# Altium schematic sheet VESC_POWER_SCH.SchDoc
size 297 x 209 mm
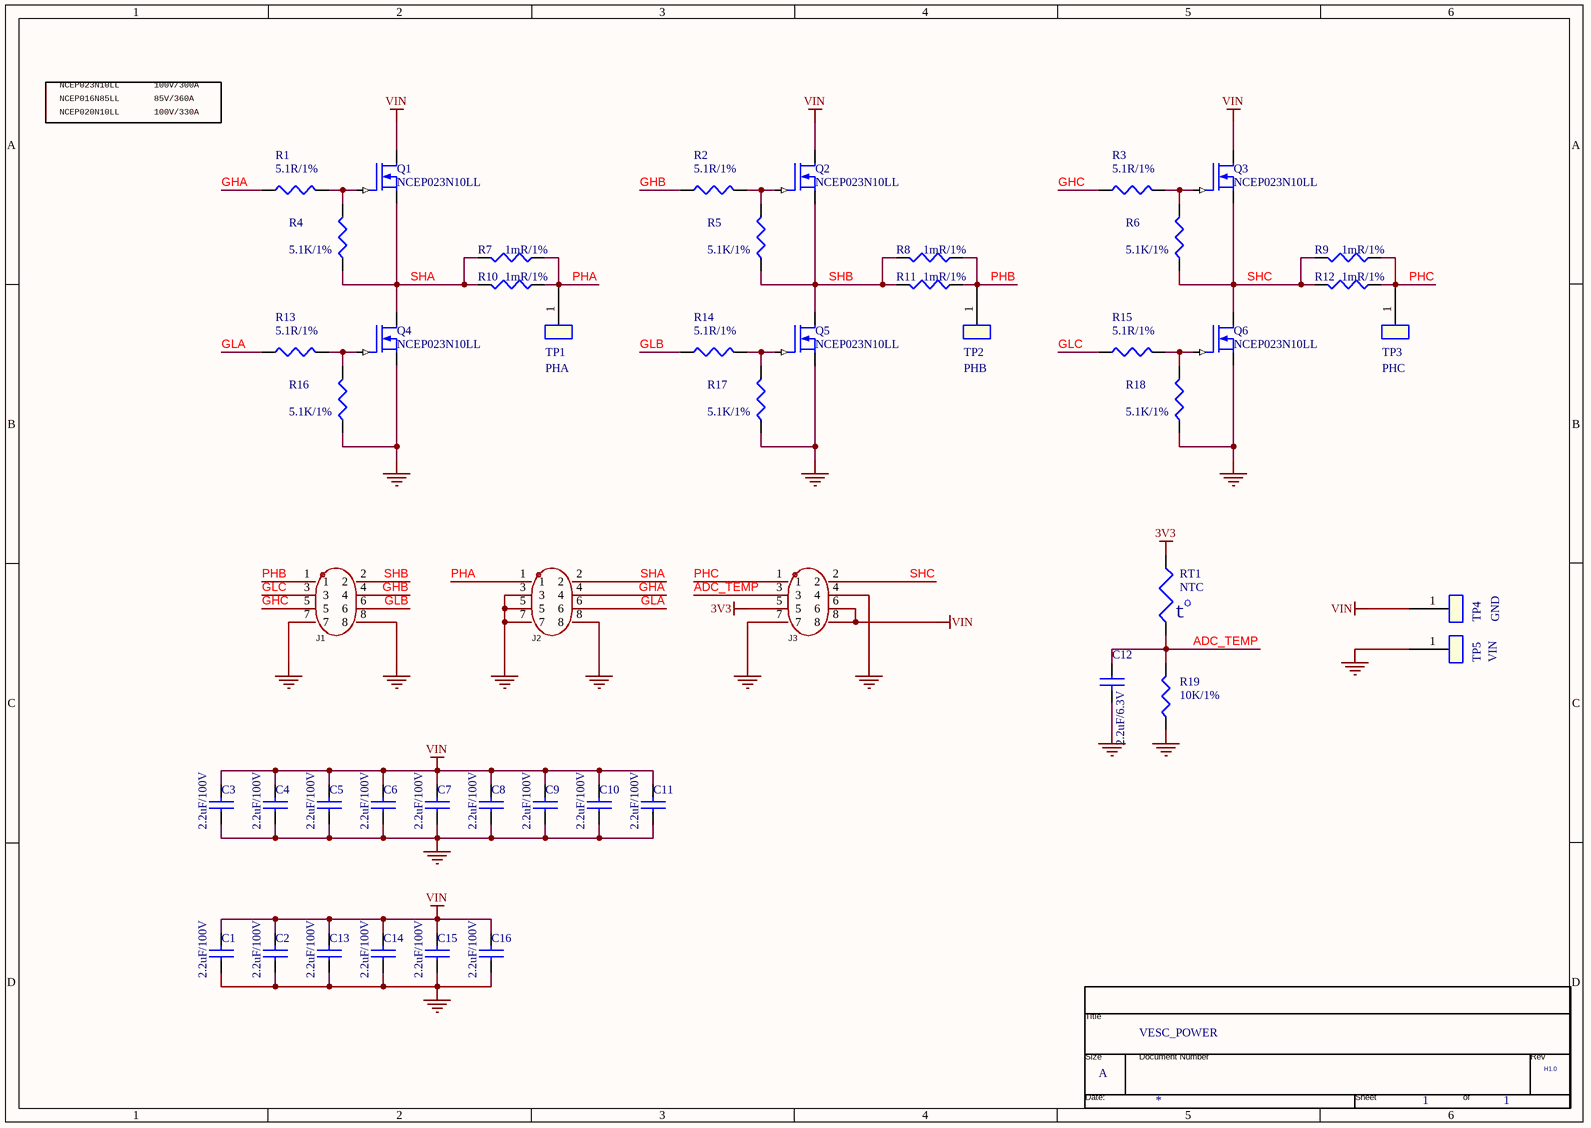
[diagram p0: VESC_POWER_SCH.SchDoc]

## Parts
*  RevCode: H1.0  Title: VESC_POWER  Page Size: A  Page Number: 1  (hidden comment: TitleBlock0)  (graphical)
C1  2.2uF/100V  [CAPC3225X230N]
C2  2.2uF/100V  [CAPC3225X230N]
C3  2.2uF/100V  [CAPC3225X230N]
C4  2.2uF/100V  [CAPC3225X230N]
C5  2.2uF/100V  [CAPC3225X230N]
C6  2.2uF/100V  [CAPC3225X230N]
C7  2.2uF/100V  [CAPC3225X230N]
C8  2.2uF/100V  [CAPC3225X230N]
C9  2.2uF/100V  [CAPC3225X230N]
C10  2.2uF/100V  [CAPC3225X230N]
C11  2.2uF/100V  [CAPC3225X230N]
C12  2.2uF/6.3V  [C0603]
C13  2.2uF/100V  [CAPC3225X230N]
C14  2.2uF/100V  [CAPC3225X230N]
C15  2.2uF/100V  [CAPC3225X230N]
C16  2.2uF/100V  [CAPC3225X230N]
J1  X6521WVS-2x04H-C60D74  [HDR-SMD_8P-P1.27-V-M-C2-C4-LS5.3]  (value not drawn)
J2  X6521WVS-2x04H-C60D74  [HDR-SMD_8P-P1.27-V-M-C2-C4-LS5.3]  (value not drawn)
J3  X6521WVS-2x04H-C60D74  [HDR-SMD_8P-P1.27-V-M-C2-C4-LS5.3]  (value not drawn)
Q1  NCEP023N10LL  [TOLL]
Q2  NCEP023N10LL  [TOLL]
Q3  NCEP023N10LL  [TOLL]
Q4  NCEP023N10LL  [TOLL]
Q5  NCEP023N10LL  [TOLL]
Q6  NCEP023N10LL  [TOLL]
R1  5.1R/1%  [R0603]
R2  5.1R/1%  [R0603]
R3  5.1R/1%  [R0603]
R4  5.1K/1%  [R0603]
R5  5.1K/1%  [R0603]
R6  5.1K/1%  [R0603]
R7  1mR/1%  [R3920]
R8  1mR/1%  [R3920]
R9  1mR/1%  [R3920]
R10  1mR/1%  [R3920]
R11  1mR/1%  [R3920]
R12  1mR/1%  [R3920]
R13  5.1R/1%  [R0603]
R14  5.1R/1%  [R0603]
R15  5.1R/1%  [R0603]
R16  5.1K/1%  [R0603]
R17  5.1K/1%  [R0603]
R18  5.1K/1%  [R0603]
R19  10K/1%  [R0603]
RT1  NTC  [R0603]
TP1  PHA  [TP_8x8]
TP2  PHB  [TP_8x8]
TP3  PHC  [TP_8x8]
TP4  GND  [TP_8x8]
TP5  VIN  [TP_8x8]

## Nets
3V3: J3.5 RT1.1
GND: C1.1 C2.1 C3.1 C4.1 C5.1 C6.1 C7.1 C8.1 C9.1 C10.1 C11.1 C12.2 C13.1 C14.1 C15.1 C16.1 J1.7 J1.8 J2.3 J2.5 J2.7 J2.8 J3.4 J3.7 Q4.3(SOURCE) Q5.3(SOURCE) Q6.3(SOURCE) R16.1 R17.1 R18.1 R19.1 TP5.1
VIN: C1.2 C2.2 C3.2 C4.2 C5.2 C6.2 C7.2 C8.2 C9.2 C10.2 C11.2 C13.2 C14.2 C15.2 C16.2 J3.6 J3.8 Q1.2(DRAIN) Q2.2(DRAIN) Q3.2(DRAIN) TP4.1
ADC_TEMP: C12.1 J3.3 R19.2 RT1.2
GHA: J2.4 R1.1
GHB: J1.4 R2.1
GHC: J1.5 R3.1
GLA: J2.6 R13.1
GLB: J1.6 R14.1
GLC: J1.3 R15.1
PHA: J2.1 R7.1 R10.1 TP1.1
PHB: J1.1 R8.1 R11.1 TP2.1
PHC: J3.1 R9.1 R12.1 TP3.1
SHA: J2.2 Q1.3(SOURCE) Q4.2(DRAIN) R4.1 R7.2 R10.2
SHB: J1.2 Q2.3(SOURCE) Q5.2(DRAIN) R5.1 R8.2 R11.2
SHC: J3.2 Q3.3(SOURCE) Q6.2(DRAIN) R6.1 R9.2 R12.2
NetQ1_1: Q1.1(GATE) R1.2 R4.2
NetQ2_1: Q2.1(GATE) R2.2 R5.2
NetQ3_1: Q3.1(GATE) R3.2 R6.2
NetQ4_1: Q4.1(GATE) R13.2 R16.2
NetQ5_1: Q5.1(GATE) R14.2 R17.2
NetQ6_1: Q6.1(GATE) R15.2 R18.2

## Notes on the sheet
- NCEP023N10LL
- NCEP020N10LL
- NCEP016N85LL
- 85V/360A
- 100V/330A
- 100V/300A
- (in symbol NTC) t
- (in symbol TitleBlock0) Title; Size; Document Number; Rev; Date:; Sheet; of

## Library data of the parts
C1-C11 C13-C16 = CAP NP: PCB Footprint: C1206
C12 = CAP NP: PCB Footprint: C0603
J1-J3 = X6521WVS-2x04H-C60D74: Manufacturer: XKB Connection(中国星坤); Symbol: X6521WVS-2*04H-C60D74; Add into BOM: yes; Pin Structure: 2x4P; Pitch: 2.54mm; Circluar Pins/Square Pins: 方针; Current Rating (Max): 3A; Voltage Rating (Max): 250V; Soldering Temperature(Max): 260℃; Device: X6521WVS-2x04H-C60D74; LCSC Part Name: 2x4P 间距:2.54mm 方针; Supplier Part: C780053; Manufacturer Part: X6521WVS-2x04H-C60D74; Supplier Footprint: SMD,P=2.54mm; JLCPCB Part Class: Extended Part; Datasheet: https://atta.szlcsc.com/upload/public/pdf/source/20211009/E3239EE5247E6BAFECB8B74A4FCF9AB8.pdf; Supplier: LCSC; Convert to PCB: yes; Row Spacing: 2.54mm; Mounting Type: -; Number of Rows: 双排; Number of Pins: 8P; Length of Mating Pin: -; Insulation Height: 2.5mm; Length of End Connection Pin: -; Contact Material: 黄铜; Contact Plating: 金; Operating Temperature Range: -40℃~+105℃; Color: 黑色
Q1-Q6 = MOSFET N: PCB Footprint: TOLL
R1-R19 = RESISTOR
  R1-R6 R13-R19: PCB Footprint: R0603
  R7-R12: PCB Footprint: R3920
TP1-TP5 = TEST POINT: PCB Footprint: TP_8x8
* = TitleBlock0: Page Create Date: March  8, 1995; Page Count: 1; Page Modify Date: *
RT1 = NTC: PCB Footprint: R0603